# Altium project DamperSectionProject.PrjPCB
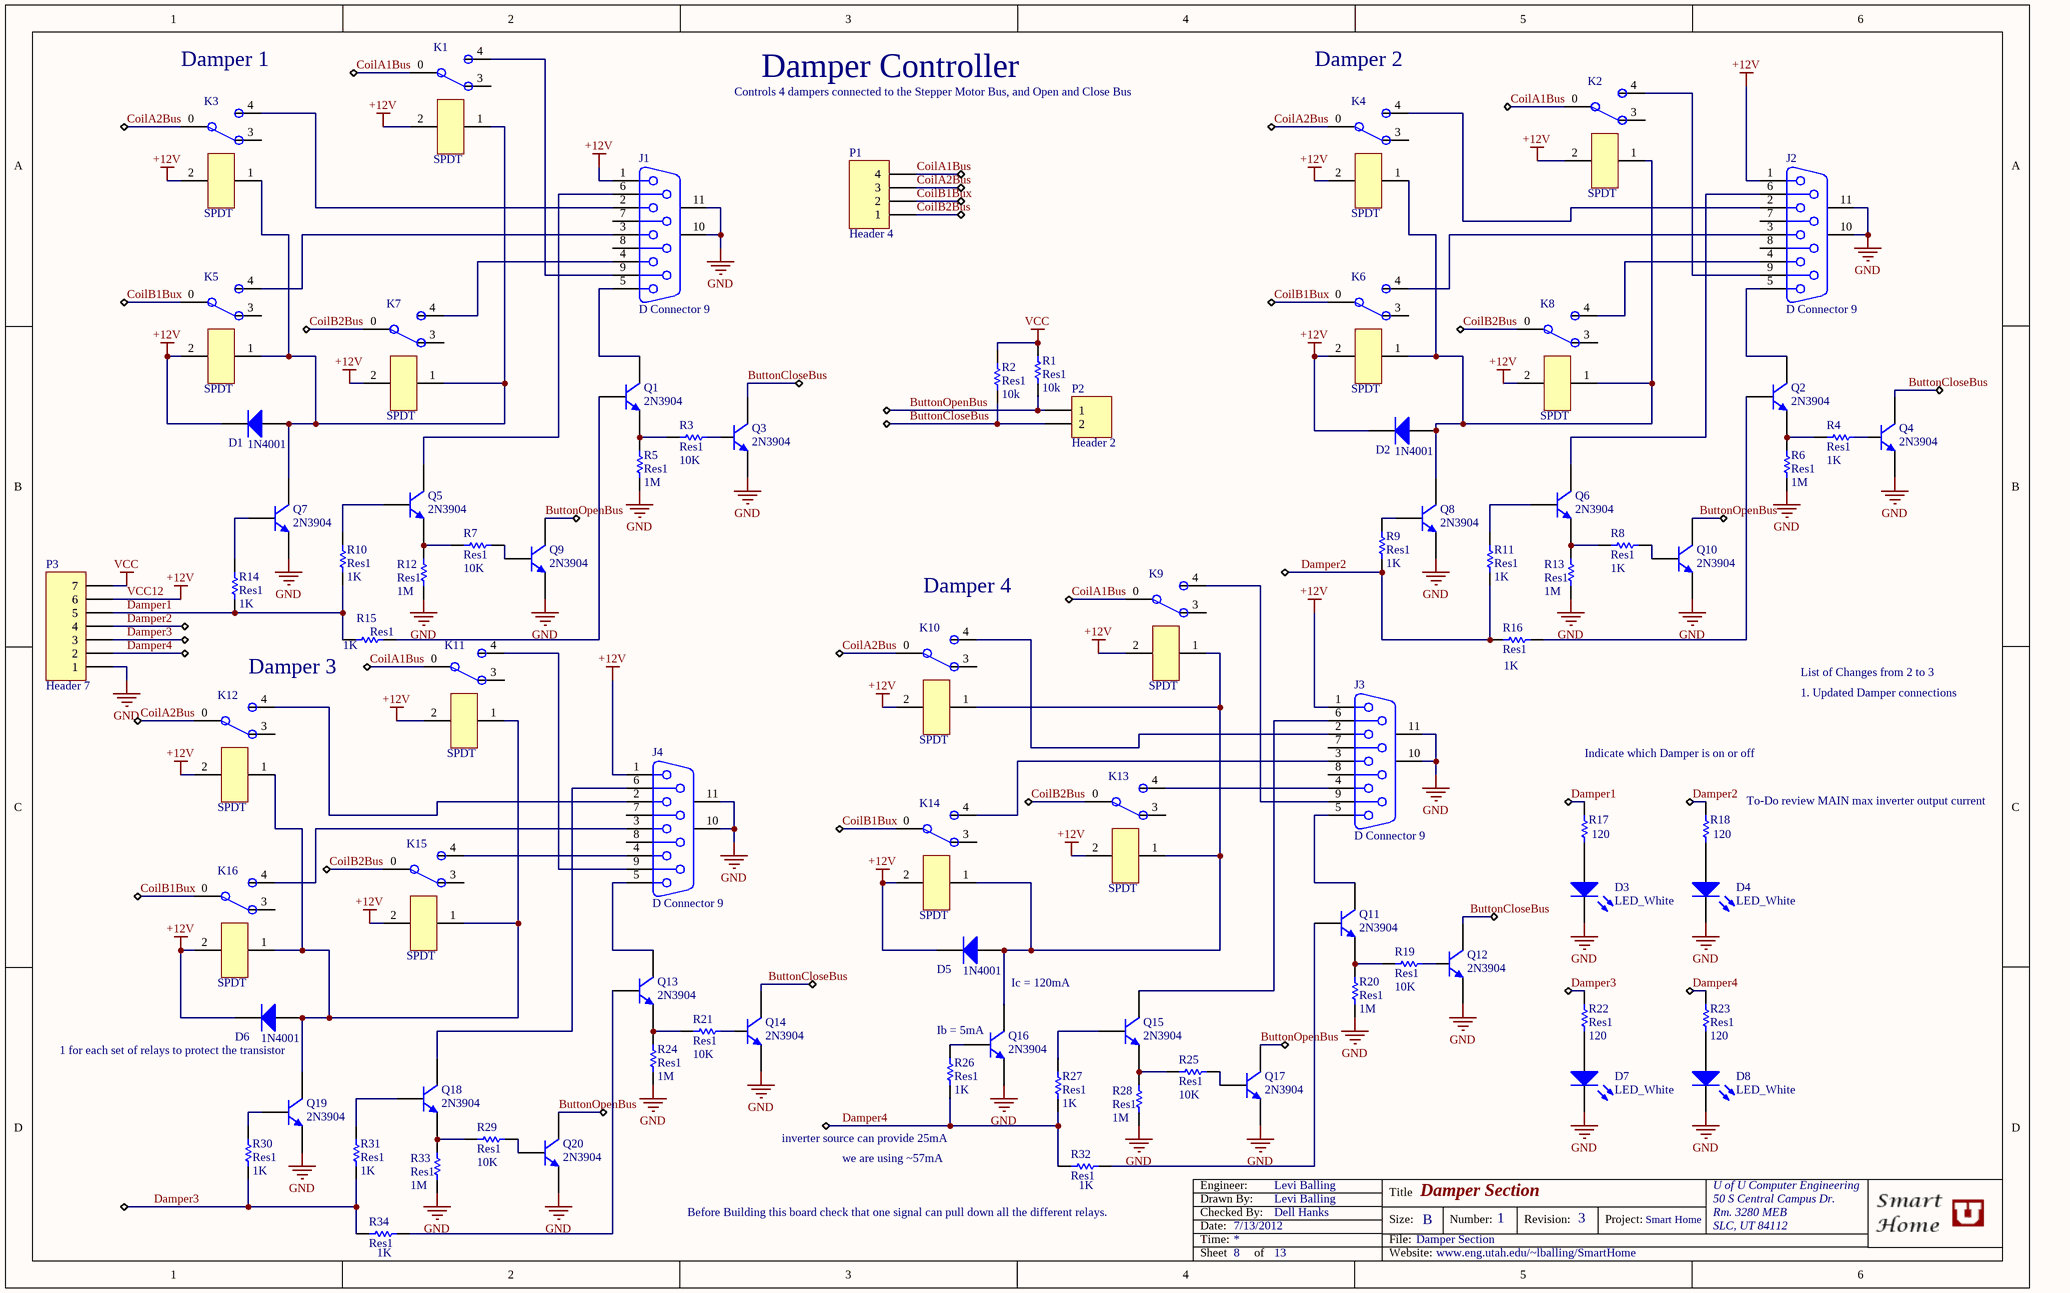
[diagram p0: DamperSection.SchDoc]
1 sheet, 85 parts. Net scope: global (net labels, ports and power ports of the same name join across sheets).
Board file: DamperSectionPCB.PcbDoc

## Sheet DamperSection.SchDoc: Damper Section
size B; Date: 7/13/2012; ApprovedBy: Levi Balling; CheckedBy: Dell Hanks; Author: Levi Balling; CompanyName: Smart Home; DrawnBy: Levi Balling; Engineer: Levi Balling; Organization: U of U Computer Engineering; Address1: 50 S Central Campus Dr.; Address2: Rm. 3280 MEB; Address3: SLC, UT 84112; DocumentNumber: 1; Revision: 3; SheetNumber: 8; SheetTotal: 13; Project: Smart Home; Website: www.eng.utah.edu/~lballing/SmartHome; CurrentDate: 7/13/2012; DocumentName: Damper Section; ProjectName: Smart Home

### Parts
D1  1N4001  [DO-41]
D2  1N4001  [DO-41]
D3  LED_White  [LED]
D4  LED_White  [LED]
D5  1N4001  [DO-41]
D6  1N4001  [DO-41]
D7  LED_White  [LED]
D8  LED_White  [LED]
J1  D Connector 9  [DSUB1.385-2H9]
J2  D Connector 9  [DSUB1.385-2H9]
J3  D Connector 9  [DSUB1.385-2H9]
J4  D Connector 9  [DSUB1.385-2H9]
K1  SPDT  [Relay - SPDT]
K2  SPDT  [Relay - SPDT]
K3  SPDT  [Relay - SPDT]
K4  SPDT  [Relay - SPDT]
K5  SPDT  [Relay - SPDT]
K6  SPDT  [Relay - SPDT]
K7  SPDT  [Relay - SPDT]
K8  SPDT  [Relay - SPDT]
K9  SPDT  [Relay - SPDT]
K10  SPDT  [Relay - SPDT]
K11  SPDT  [Relay - SPDT]
K12  SPDT  [Relay - SPDT]
K13  SPDT  [Relay - SPDT]
K14  SPDT  [Relay - SPDT]
K15  SPDT  [Relay - SPDT]
K16  SPDT  [Relay - SPDT]
P1  Header 4  [HDR1X4]
P2  Header 2  [HDR1X2]
P3  Header 7  [HDR1X7]
Q1  2N3904  [2N3904]
Q2  2N3904  [2N3904]
Q3  2N3904  [2N3904]
Q4  2N3904  [2N3904]
Q5  2N3904  [2N3904]
Q6  2N3904  [2N3904]
Q7  2N3904  [2N3904]
Q8  2N3904  [2N3904]
Q9  2N3904  [2N3904]
Q10  2N3904  [2N3904]
Q11  2N3904  [2N3904]
Q12  2N3904  [2N3904]
Q13  2N3904  [2N3904]
Q14  2N3904  [2N3904]
Q15  2N3904  [2N3904]
Q16  2N3904  [2N3904]
Q17  2N3904  [2N3904]
Q18  2N3904  [2N3904]
Q19  2N3904  [2N3904]
Q20  2N3904  [2N3904]
R1  Res1  value 10k  [AXIAL-0.3]
R2  Res1  value 10k  [AXIAL-0.3]
R3  Res1  value 10K  [AXIAL-0.3]
R4  Res1  value 1K  [AXIAL-0.3]
R5  Res1  value 1M  [AXIAL-0.3]
R6  Res1  value 1M  [AXIAL-0.3]
R7  Res1  value 10K  [AXIAL-0.3]
R8  Res1  value 1K  [AXIAL-0.3]
R9  Res1  value 1K  [AXIAL-0.3]
R10  Res1  value 1K  [AXIAL-0.3]
R11  Res1  value 1K  [AXIAL-0.3]
R12  Res1  value 1M  [AXIAL-0.3]
R13  Res1  value 1M  [AXIAL-0.3]
R14  Res1  value 1K  [AXIAL-0.3]
R15  Res1  value 1K  [AXIAL-0.3]
R16  Res1  value 1K  [AXIAL-0.3]
R17  value 120  [AXIAL-0.3]  (hidden comment: Res1)
R18  120  [AXIAL-0.3]
R19  Res1  value 10K  [AXIAL-0.3]
R20  Res1  value 1M  [AXIAL-0.3]
R21  Res1  value 10K  [AXIAL-0.3]
R22  Res1  value 120  [AXIAL-0.3]
R23  Res1  value 120  [AXIAL-0.3]
R24  Res1  value 1M  [AXIAL-0.3]
R25  Res1  value 10K  [AXIAL-0.3]
R26  Res1  value 1K  [AXIAL-0.3]
R27  Res1  value 1K  [AXIAL-0.3]
R28  Res1  value 1M  [AXIAL-0.3]
R29  Res1  value 10K  [AXIAL-0.3]
R30  Res1  value 1K  [AXIAL-0.3]
R31  Res1  value 1K  [AXIAL-0.3]
R32  Res1  value 1K  [AXIAL-0.3]
R33  Res1  value 1M  [AXIAL-0.3]
R34  Res1  value 1K  [AXIAL-0.3]

### Nets
GND: D3.2(K) D4.2(K) D7.2(K) D8.2(K) J1.10(MH1) J1.11(MH2) J2.10(MH1) J2.11(MH2) J3.10(MH1) J3.11(MH2) J4.10(MH1) J4.11(MH2) P3.1 Q3.1(E) Q4.1(E) Q7.1(E) Q8.1(E) Q9.1(E) Q10.1(E) Q12.1(E) Q14.1(E) Q16.1(E) Q17.1(E) Q19.1(E) Q20.1(E) R5.1 R6.1 R12.1 R13.1 R20.1 R24.1 R28.1 R33.1
VCC: P3.7 R1.2 R2.2
VCC12: D1.2(K) D2.2(K) D5.2(K) D6.2(K) J1.1 J2.1 J3.1 J4.1 K1.2 K2.2 K3.2 K4.2 K5.2 K6.2 K7.2 K8.2 K9.2 K10.2 K11.2 K12.2 K13.2 K14.2 K15.2 K16.2 P3.6  [also labelled +12V]
ButtonCloseBus: P2.2 Q3.3(C) Q4.3(C) Q12.3(C) Q14.3(C) R2.1
ButtonOpenBus: P2.1 Q9.3(C) Q10.3(C) Q17.3(C) Q20.3(C) R1.1
CoilA1Bus: K1.0 K2.0 K9.0 K11.0 P1.4
CoilA2Bus: K3.0 K4.0 K10.0 K12.0 P1.3
CoilB1Bux: K5.0 K6.0 K14.0 K16.0 P1.2
CoilB2Bus: K7.0 K8.0 K13.0 K15.0 P1.1
Damper1: P3.5 R10.1 R14.1 R15.1 R17.1
Damper2: P3.4 R9.1 R11.1 R16.1 R18.1
Damper3: P3.3 R22.1 R30.1 R31.1 R34.1
Damper4: P3.2 R23.1 R26.1 R27.1 R32.1
NetD1_1: D1.1(A) K1.1 K3.1 K5.1 K7.1 Q7.3(C)
NetD2_1: D2.1(A) K2.1 K4.1 K6.1 K8.1 Q8.3(C)
NetD3_1: D3.1(A) R17.2
NetD4_1: D4.1(A) R18.2
NetD5_1: D5.1(A) K9.1 K10.1 K13.1 K14.1 Q16.3(C)
NetD6_1: D6.1(A) K11.1 K12.1 K15.1 K16.1 Q19.3(C)
NetD7_1: D7.1(A) R22.2
NetD8_1: D8.1(A) R23.2
NetJ1_2: J1.2 K3.4
NetJ1_3: J1.3 K5.4
NetJ1_4: J1.4 K7.4
NetJ1_5: J1.5 Q1.3(C)
NetJ1_6: J1.6 Q5.3(C)
NetJ1_9: J1.9 K1.4
NetJ2_2: J2.2 K4.4
NetJ2_3: J2.3 K6.4
NetJ2_4: J2.4 K8.4
NetJ2_5: J2.5 Q2.3(C)
NetJ2_6: J2.6 Q6.3(C)
NetJ2_9: J2.9 K2.4
NetJ3_2: J3.2 K10.4
NetJ3_3: J3.3 K14.4
NetJ3_4: J3.4 K13.4
NetJ3_5: J3.5 Q11.3(C)
NetJ3_6: J3.6 Q15.3(C)
NetJ3_9: J3.9 K9.4
NetJ4_2: J4.2 K12.4
NetJ4_3: J4.3 K16.4
NetJ4_4: J4.4 K15.4
NetJ4_5: J4.5 Q13.3(C)
NetJ4_6: J4.6 Q18.3(C)
NetJ4_9: J4.9 K11.4
NetQ1_1: Q1.1(E) R3.1 R5.2
NetQ1_2: Q1.2(B) R15.2
NetQ2_1: Q2.1(E) R4.1 R6.2
NetQ2_2: Q2.2(B) R16.2
NetQ3_2: Q3.2(B) R3.2
NetQ4_2: Q4.2(B) R4.2
NetQ5_1: Q5.1(E) R7.1 R12.2
NetQ5_2: Q5.2(B) R10.2
NetQ6_1: Q6.1(E) R8.1 R13.2
NetQ6_2: Q6.2(B) R11.2
NetQ7_2: Q7.2(B) R14.2
NetQ8_2: Q8.2(B) R9.2
NetQ9_2: Q9.2(B) R7.2
NetQ10_2: Q10.2(B) R8.2
NetQ11_1: Q11.1(E) R19.1 R20.2
NetQ11_2: Q11.2(B) R32.2
NetQ12_2: Q12.2(B) R19.2
NetQ13_1: Q13.1(E) R21.1 R24.2
NetQ13_2: Q13.2(B) R34.2
NetQ14_2: Q14.2(B) R21.2
NetQ15_1: Q15.1(E) R25.1 R28.2
NetQ15_2: Q15.2(B) R27.2
NetQ16_2: Q16.2(B) R26.2
NetQ17_2: Q17.2(B) R25.2
NetQ18_1: Q18.1(E) R29.1 R33.2
NetQ18_2: Q18.2(B) R31.2
NetQ19_2: Q19.2(B) R30.2
NetQ20_2: Q20.2(B) R29.2

Not connected (* = marked no-connect by the designer): J1 7 8; J2 7 8; J3 7 8; J4 7 8; K1 3; K2 3; K3 3; K4 3; K5 3; K6 3; K7 3; K8 3; K9 3; K10 3; K11 3; K12 3; K13 3; K14 3; K15 3; K16 3

### Notes on the sheet
- (near K3) Damper 1
- Controls 4 dampers connected to the Stepper Motor Bus, and Open and Close Bus
- Damper Controller
- (near K4) Damper 2
- (near K10) Damper 4
- Damper 3
- List of Changes from 2 to 3
- 1. Updated Damper connections
- Indicate which Damper is on or off
- (near R18) To-Do review MAIN max inverter output current
- (near Q16) Ib = 5mA
- Ic = 120mA
- 1 for each set of relays to protect the transistor
- (near R26) inverter source can provide 25mA
- we are using ~57mA
- (near R32) Before Building this board check that one signal can pull down all the different relays.
- Date:
- Time:
- Engineer:
- Drawn By:
- Checked By:
- Title
- Size:
- File:
- B
- Number:
- Revision:
- Project:
- Sheet
- of
- Website:

### Library data of the parts
D1 D2 D5 D6 = 1N4001: 1.0 Ampere General Purpose Rectifier; Vendor: Taydaelectronics; Published: 8-Jun-2000; LatestRevisionDate: 17-Jul-2002; LatestRevisionNote: Re-released for DXP Platform.; DatasheetDocument: 1998; PackageDocument: Aug-1999; PackageReference: DO-41; Publisher: Altium Limited; Code_JEDEC: DO-204-AL; ComponentLink1Description: Manufacturer Link; ComponentLink1URL: http://www.fairchildsemi.com/; ComponentLink2Description: Pinout Specification; ComponentLink2URL: http://www.fairchildsemi.com/ds/1N%2F1N4001.pdf; Price: 0.01; Value: 1N4001
D3 D4 D7 D8 = LED0: Typical INFRARED GaAs LED; Vendor: Taydaelectronics; Value: White_LED; Published: 8-Jun-2000; LatestRevisionDate: 08-Jul-2005; LatestRevisionNote: Mech Layer 1 removed.; PackageReference: LED-0; Publisher: Altium Limited; PackageDescription: LED; 2 Leads; Price: 0.04
J1-J4 = D Connector 9: Receptacle Assembly, 9 Position, Right Angle; PackageDocument: O; Positions: 9; Vendor: Taydaelectronics; Published: 15-Jun-2001; LatestRevisionDate: 17-Jul-2002; LatestRevisionNote: Re-released for DXP Platform.; DatasheetDocument: 1-Sep-1999; PackageReference: 788750; Publisher: Altium Limited; Orientation: Right Angle; Gender: Receptacle; Price: 0.48; Value: D Connector 9
K1-K16 = SPDT: Vendor: Taydaelectronics; Coil Resistance: 400; Price: 0.64
P1 = Header 4: Header, 4-Pin; Vendor: Taydaelectronics; LatestRevisionDate: 17-Jul-2002; LatestRevisionNote: Re-released for DXP Platform.; Publisher: Altium Limited; Price: 0.04; Value: Header 4
P2 = Header 2: Header, 2-Pin; Vendor: Taydaelectronics; LatestRevisionDate: 17-Jul-2002; LatestRevisionNote: Re-released for DXP Platform.; Publisher: Altium Limited; Price: 0.02; Value: Header 2
P3 = Header 7: Header, 7-Pin; Vendor: Taydaelectronics; LatestRevisionDate: 17-Jul-2002; LatestRevisionNote: Re-released for DXP Platform.; Publisher: Altium Limited; Price: 0.07; Value: Header 7
Q1-Q20 = 2N3904: NPN General Purpose Amplifier; Vendor: Taydaelectronics; Published: 8-Jun-2000; LatestRevisionDate: 15-Jan-2003; LatestRevisionNote: PCB Footprint 'BCY-W3/D4.7' replaced; DatasheetVersion: 1997; PackageVersion: Sep-1998; PackageReference: TO-92A; Publisher: Altium Limited; PackageDescription: TO, Flat Index; 3 In-Line, Axial Leads; Body Dia. 4.5mm; Leads 0.51 x 0.48 mm (max); ComponentLink1URL: http://www.fairchildsemi.com/; ComponentLink2Description: Datasheet; ComponentLink2URL: http://www.fairchildsemi.com/ds/2N%2F2N3904.pdf; Price: 0.01; Value: 2N3904
R1-R34 = Res1: Resistor; Vendor: Taydaelectronics; Published: 8-Jun-2000; LatestRevisionDate: 17-Jul-2002; LatestRevisionNote: Re-released for DXP Platform.; PackageReference: AXIAL-0.3; Publisher: Altium Limited; PackageDescription: Axial Device, Thru-Hole; 2 Leads; 0.3 in Pin Spacing; Price: 0.01
  R18: Value: 120